# Altium schematic sheet 2016_CARTE_PUISSANCE.SchDoc
size A4
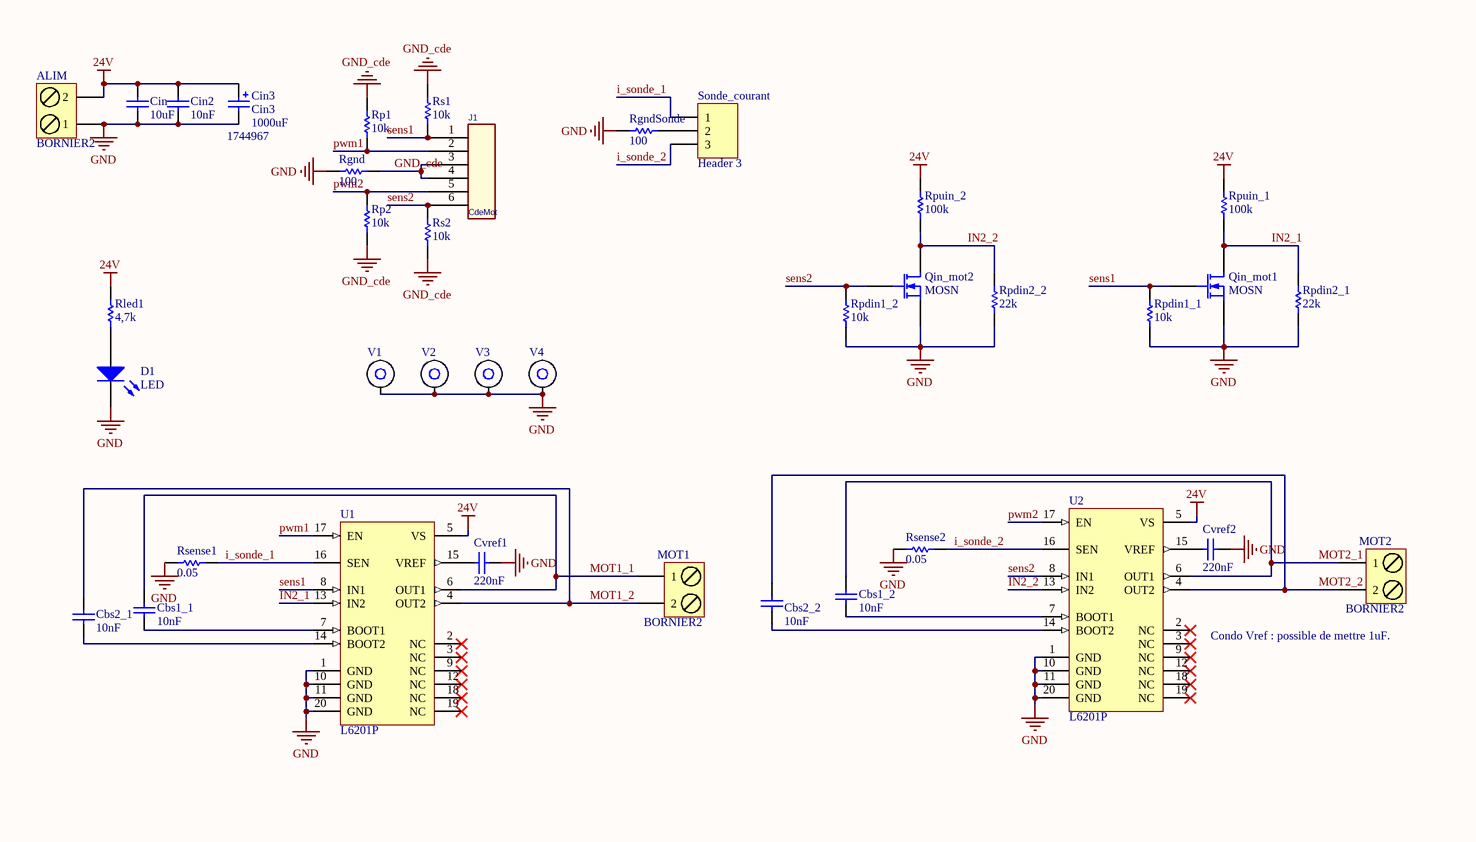
[diagram p0: 2016_CARTE_PUISSANCE.SchDoc, left]
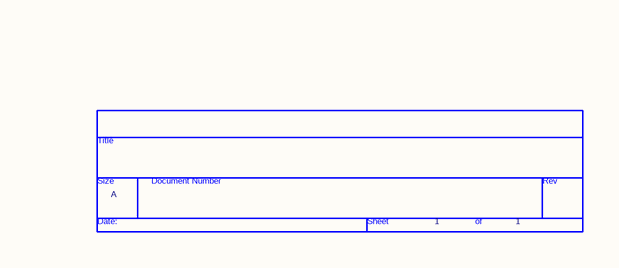
[diagram p1: 2016_CARTE_PUISSANCE.SchDoc, right]

## Parts
*  Page Count: 1  Page Size: A  (hidden comment: TitleBlock0)  (graphical)
ALIM  BORNIER2  [BORNIER2]
Cbs1_1  10nF  [C0805_N]
Cbs1_2  10nF  [C0805_N]
Cbs2_1  10nF  [C0805_N]
Cbs2_2  10nF  [C0805_N]
Cin  10uF  [C1206_N]
Cin2  10nF  [C0805_N]
Cin3  Cin3  value 1000uF  FAR: 1744967  [COND_POL_RAD_5.08B]
Cvref1  220nF  [C0805_N]
Cvref2  220nF  [C0805_N]
D1  LED  [LED_3mm]
J1  CdeMot  [RJ11_6/6]
MOT1  BORNIER2  [BORNIER2]
MOT2  BORNIER2  [BORNIER2]
Qin_mot1  MOSN  [SOT23-3N]
Qin_mot2  MOSN  [SOT23-3N]
Rgnd  100  [R1206_N]
RgndSonde  100  [R1206_N]
Rled1  4,7k  [R1206_N]
Rp1  10k  [R1206_N]
Rp2  10k  [R1206_N]
Rpdin1_1  10k  [R1206_N]
Rpdin1_2  10k  [R1206_N]
Rpdin2_1  22k  [R1206_N]
Rpdin2_2  22k  [R1206_N]
Rpuin_1  100k  [R1206_N]
Rpuin_2  100k  [R1206_N]
Rs1  10k  [R1206_N]
Rs2  10k  [R1206_N]
Rsense1  0.05  [R2512_N]
Rsense2  0.05  [R2512_N]
Sonde_courant  Header 3  [HDR1X3]
U1  L6201P  [PowerSO20_N]
U2  L6201P  [PowerSO20_N]
V1  Entretoise WURTH CMS  [ENTRETOISE_CMS]  (value not drawn)
V2  Entretoise WURTH CMS  [ENTRETOISE_CMS]  (value not drawn)
V3  Entretoise WURTH CMS  [ENTRETOISE_CMS]  (value not drawn)
V4  Entretoise WURTH CMS  [ENTRETOISE_CMS]  (value not drawn)

## Nets
24V: ALIM.2 Cin.2 Cin2.2 Cin3.1 Rled1.2 Rpuin_1.2 Rpuin_2.2 U1.5(VS) U2.5(VS)
GND: ALIM.1 Cin.1 Cin2.1 Cin3.2 Cvref1.1 Cvref2.1 D1.2 Qin_mot1.2(S) Qin_mot2.2(S) Rgnd.2 RgndSonde.2 Rpdin1_1.2 Rpdin1_2.2 Rpdin2_1.1 Rpdin2_2.1 Rsense1.1 Rsense2.1 U1.1(GND) U1.10(GND) U1.11(GND) U1.20(GND) U2.1(GND) U2.10(GND) U2.11(GND) U2.20(GND) V1.1 V2.1 V3.1 V4.1
GND_cde: J1.3 J1.4 Rgnd.1 Rp1.2 Rp2.1 Rs1.2 Rs2.1
i_sonde_1: Rsense1.2 Sonde_courant.1 U1.16(SEN)
i_sonde_2: Rsense2.2 Sonde_courant.3 U2.16(SEN)
IN2_1: Qin_mot1.3(D) Rpdin2_1.2 Rpuin_1.1 U1.13(IN2)
IN2_2: Qin_mot2.3(D) Rpdin2_2.2 Rpuin_2.1 U2.13(IN2)
MOT1_1: Cbs1_1.2 MOT1.1 U1.6(OUT1)
MOT1_2: Cbs2_1.2 MOT1.2 U1.4(OUT2)
MOT2_1: Cbs1_2.2 MOT2.1 U2.6(OUT1)
MOT2_2: Cbs2_2.2 MOT2.2 U2.4(OUT2)
pwm1: J1.2 Rp1.1 U1.17(EN)
pwm2: J1.5 Rp2.2 U2.17(EN)
sens1: J1.1 Qin_mot1.1(G) Rpdin1_1.1 Rs1.1 U1.8(IN1)
sens2: J1.6 Qin_mot2.1(G) Rpdin1_2.1 Rs2.2 U2.8(IN1)
NetCbs1_1_1: Cbs1_1.1 U1.7(BOOT1)
NetCbs1_2_1: Cbs1_2.1 U2.7(BOOT1)
NetCbs2_1_1: Cbs2_1.1 U1.14(BOOT2)
NetCbs2_2_1: Cbs2_2.1 U2.14(BOOT2)
NetCvref1_2: Cvref1.2 U1.15(VREF)
NetCvref2_2: Cvref2.2 U2.15(VREF)
NetD1_1: D1.1 Rled1.1
NetRgndSonde_1: RgndSonde.1 Sonde_courant.2

Not connected (* = marked no-connect by the designer): U1 2(NC)* 3(NC)* 9(NC)* 12(NC)* 18(NC)* 19(NC)*; U2 2(NC)* 3(NC)* 9(NC)* 12(NC)* 18(NC)* 19(NC)*

## Notes on the sheet
- Condo Vref : possible de mettre 1uF.
- (in symbol TitleBlock0) Title; Size; Document Number; Rev; Date:; Sheet; of

## Library data of the parts
ALIM MOT1 MOT2 = BORNIER2: Terminal blocks, 2 pins, pitch=5mm
Cbs1_1 Cbs1_2 Cbs2_1 Cbs2_2 Cin Cin2 Cvref1 Cvref2 = Capacitor: Published: 8-Jun-2000; LatestRevisionDate: 17-Jul-2002; LatestRevisionNote: Re-released for DXP Platform.; PackageReference: RAD-0.3; Publisher: Altium Limited
Cin3 = CONDENSATEUR_POLARISE: Polarized Capacitor; Published: 8-Jun-2000; LatestRevisionDate: 17-Jul-2002; LatestRevisionNote: Re-released for DXP Platform.; PackageReference: RB7.6-15; Publisher: Altium Limited
D1 = LED: Typical LED; Published: 8-Jun-2000; LatestRevisionDate: 08-Jul-2005; LatestRevisionNote: Mech Layer 1 removed.; PackageReference: LED-1; Publisher: Altium Limited
J1 = CONNECTEUR_RJ12
Qin_mot1 Qin_mot2 = Transistor MOSFET-N: N-Channel MOSFET; PackageDocument: 1995/1996; Published: 8-Jun-2000; LatestRevisionDate: 17-Jul-2002; LatestRevisionNote: Re-released for DXP Platform.; PackageReference: E3; Publisher: Altium Limited
Rgnd RgndSonde Rled1 Rp1 Rp2 Rpdin1_1 Rpdin1_2 Rpdin2_1 Rpdin2_2 Rpuin_1 Rpuin_2 Rs1 Rs2 Rsense1 Rsense2 = Resistor: Published: 8-Jun-2000; LatestRevisionDate: 17-Jul-2002; LatestRevisionNote: Re-released for DXP Platform.; PackageReference: AXIAL-0.5; Publisher: Altium Limited
Sonde_courant = Header 3: Header, 3-Pin; LatestRevisionDate: 17-Jul-2002; LatestRevisionNote: Re-released for DXP Platform.; Publisher: Altium Limited
U1 U2 = L6201P: DMOS Full Bridge Driver; Published: 8-Jun-2000; LatestRevisionDate: 13-Apr-2006; LatestRevisionNote: IPC-7351 Footprint Added.; DatasheetVersion: Sep-1996; PackageVersion: May-1998; PackageReference: PowerSO20; Publisher: Altium Limited; PackageDescription: 20-Pin Small Outline Package 1.27 mm Pitch; Code_JEDEC: MO-166; ComponentLink1Description: Manufacturer Link; ComponentLink1URL: http://www.st.com/
V1-V4 = Entretoise WURTH CMS: Entretoise Wurth; Publisher: Damien Guitton
* = TitleBlock0: Page Number: 1; Page Create Date: March  8, 1995